# Altium schematic sheet APM9328_CONNECTORR.SchDoc: CONNECTOR R
size A4; Author: R; Revision: 1.0; SheetNumber: 8; SheetTotal: 14
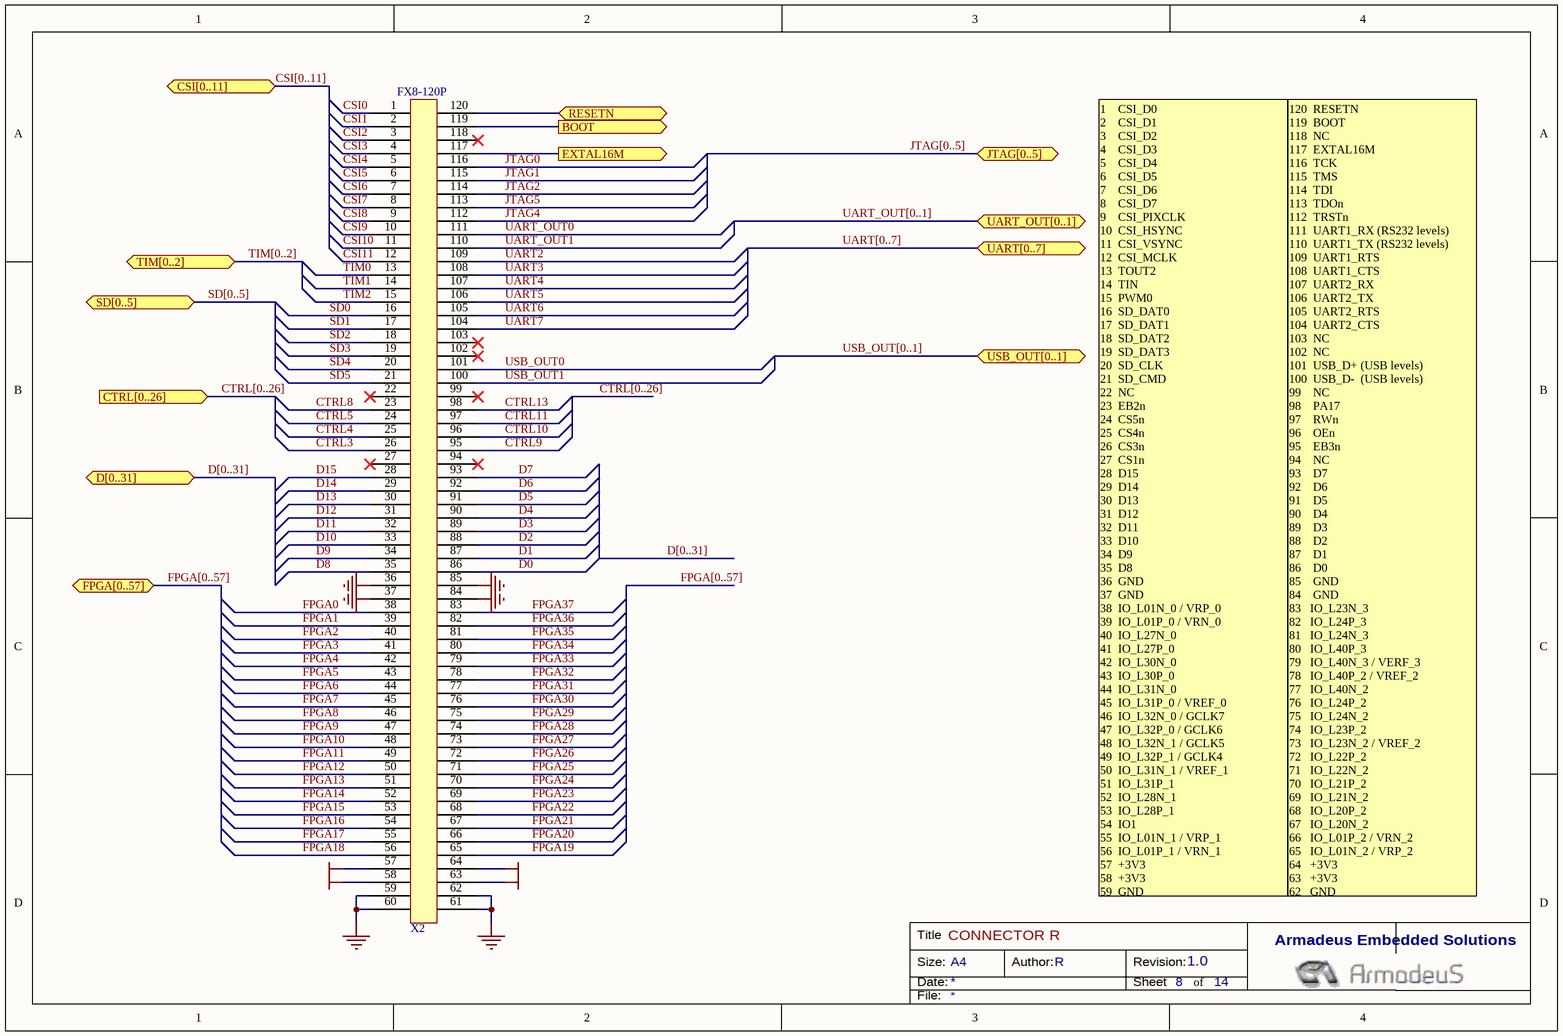
[diagram p0: APM9328_CONNECTORR.SchDoc]

## Parts
X2  FX8-120P  [FX8-120P]

## Ports
BOOT (out), CSI[0..11] (bidir), CTRL[0..26] (in), D[0..31] (bidir), EXTAL16M (out), FPGA[0..57] (bidir), JTAG[0..5] (bidir), RESETN (bidir), SD[0..5] (bidir), TIM[0..2] (bidir), UART[0..7] (bidir), UART_OUT[0..1] (bidir), USB_OUT[0..1] (bidir)

## Nets
+3V3: X2.57 X2.58 X2.63 X2.64
GND: X2.36 X2.37 X2.59 X2.60 X2.61 X2.62 X2.84 X2.85
BOOT: X2.119 ; port BOOT
CSI0: X2.1
CSI1: X2.2
CSI2: X2.3
CSI3: X2.4
CSI4: X2.5
CSI5: X2.6
CSI6: X2.7
CSI7: X2.8
CSI8: X2.9
CSI9: X2.10
CSI10: X2.11
CSI11: X2.12
CTRL3: X2.26
CTRL4: X2.25
CTRL5: X2.24
CTRL8: X2.23
CTRL9: X2.95
CTRL10: X2.96
CTRL11: X2.97
CTRL13: X2.98
D0: X2.86
D1: X2.87
D2: X2.88
D3: X2.89
D4: X2.90
D5: X2.91
D6: X2.92
D7: X2.93
D8: X2.35
D9: X2.34
D10: X2.33
D11: X2.32
D12: X2.31
D13: X2.30
D14: X2.29
D15: X2.28
EXTAL16M: X2.117 ; port EXTAL16M
FPGA0: X2.38
FPGA1: X2.39
FPGA2: X2.40
FPGA3: X2.41
FPGA4: X2.42
FPGA5: X2.43
FPGA6: X2.44
FPGA7: X2.45
FPGA8: X2.46
FPGA9: X2.47
FPGA10: X2.48
FPGA11: X2.49
FPGA12: X2.50
FPGA13: X2.51
FPGA14: X2.52
FPGA15: X2.53
FPGA16: X2.54
FPGA17: X2.55
FPGA18: X2.56
FPGA19: X2.65
FPGA20: X2.66
FPGA21: X2.67
FPGA22: X2.68
FPGA23: X2.69
FPGA24: X2.70
FPGA25: X2.71
FPGA26: X2.72
FPGA27: X2.73
FPGA28: X2.74
FPGA29: X2.75
FPGA30: X2.76
FPGA31: X2.77
FPGA32: X2.78
FPGA33: X2.79
FPGA34: X2.80
FPGA35: X2.81
FPGA36: X2.82
FPGA37: X2.83
JTAG0: X2.116
JTAG1: X2.115
JTAG2: X2.114
JTAG4: X2.112
JTAG5: X2.113
RESETN: X2.120 ; port RESETN
SD0: X2.16
SD1: X2.17
SD2: X2.18
SD3: X2.19
SD4: X2.20
SD5: X2.21
TIM0: X2.13
TIM1: X2.14
TIM2: X2.15
UART2: X2.109
UART3: X2.108
UART4: X2.107
UART5: X2.106
UART6: X2.105
UART7: X2.104
UART_OUT0: X2.111
UART_OUT1: X2.110
USB_OUT0: X2.101
USB_OUT1: X2.100

Not connected (* = marked no-connect by the designer): X2 22* 27* 94* 99* 102* 103* 118*

## Buses and harness runs
bus CSI[0..11] = port CSI[0..11]
bus CTRL[0..26]
bus CTRL[0..26] = port CTRL[0..26]
bus D[0..31]
bus D[0..31] = port D[0..31]
bus FPGA[0..57]
bus FPGA[0..57] = port FPGA[0..57]
bus JTAG[0..5] = port JTAG[0..5]
bus SD[0..5] = port SD[0..5]
bus TIM[0..2] = port TIM[0..2]
bus UART[0..7] = port UART[0..7]
bus UART_OUT[0..1] = port UART_OUT[0..1]
bus USB_OUT[0..1] = port USB_OUT[0..1]

## Notes on the sheet
- 1    CSI_D0
  2    CSI_D1
  3    CSI_D2
  4    CSI_D3
  5    CSI_D4
  6    CSI_D5
  7    CSI_D6
  8    CSI_D7
  9    CSI_PIXCLK
  10  CSI_HSYNC
  11  CSI_VSYNC
  12  CSI_MCLK
  13  TOUT2
  14  TIN
  15  PWM0
  16  SD_DAT0
  17  SD_DAT1
  18  SD_DAT2
  19  SD_DAT3
  20  SD_CLK
  21  SD_CMD
  22  NC
  23  EB2n
  24  CS5n
  25  CS4n
  26  CS3n
  27  CS1n
  28  D15
  29  D14
  30  D13
  31  D12
  32  D11
  33  D10
  34  D9
  35  D8
  36  GND
  37  GND
  38  IO_L01N_0 / VRP_0
  39  IO_L01P_0 / VRN_0
  40  IO_L27N_0
  41  IO_L27P_0
  42  IO_L30N_0
  43  IO_L30P_0
  44  IO_L31N_0
  45  IO_L31P_0 / VREF_0
  46  IO_L32N_0 / GCLK7
  47  IO_L32P_0 / GCLK6
  48  IO_L32N_1 / GCLK5
  49  IO_L32P_1 / GCLK4
  50  IO_L31N_1 / VREF_1
  51  IO_L31P_1
  52  IO_L28N_1
  53  IO_L28P_1
  54  IO1
  55  IO_L01N_1 / VRP_1
  56  IO_L01P_1 / VRN_1
  57  +3V3
  58  +3V3
  59  GND
  60  GND
- 120  RESETN
  119  BOOT
  118  NC
  117  EXTAL16M
  116  TCK
  115  TMS
  114  TDI
  113  TDOn
  112  TRSTn
  111  UART1_RX (RS232 levels)
  110  UART1_TX (RS232 levels)
  109  UART1_RTS
  108  UART1_CTS
  107  UART2_RX
  106  UART2_TX
  105  UART2_RTS
  104  UART2_CTS
  103  NC
  102  NC
  101  USB_D+ (USB levels)
  100  USB_D-  (USB levels)
  99    NC
  98    PA17
  97    RWn
  96    OEn
  95    EB3n
  94    NC
  93    D7
  92    D6
  91    D5
  90    D4
  89    D3
  88    D2
  87    D1
  86    D0
  85    GND
  84    GND
  83   IO_L23N_3
  82   IO_L24P_3
  81   IO_L24N_3
  80   IO_L40P_3
  79   IO_L40N_3 / VERF_3
  78   IO_L40P_2 / VREF_2
  77   IO_L40N_2
  76   IO_L24P_2
  75   IO_L24N_2
  74   IO_L23P_2
  73   IO_L23N_2 / VREF_2
  72   IO_L22P_2
  71   IO_L22N_2
  70   IO_L21P_2
  69   IO_L21N_2
  68   IO_L20P_2
  67   IO_L20N_2
  66   IO_L01P_2 / VRN_2
  65   IO_L01N_2 / VRP_2
  64   +3V3
  63   +3V3
  62   GND
  61   GND
- Title
- Size:
- Date:
- A4
- Author:
- Revision:
- Sheet
- of
- Armadeus Embedded Solutions
- File:

## Library data of the parts
X2 = FX8-120P: Fine Pitch Connector; Manufacturer: Hirose; Part Number: FX8-120P-SV; Distributor: Digikey; Price_100: 2,25; Price_500: 1,688; Price_1000: 1,63